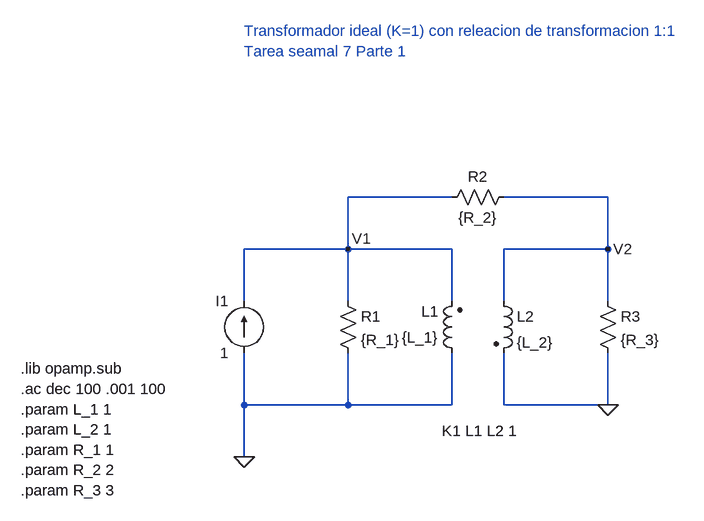
[diagram p0: schematic trafo.asc]
trafo.asc, the LTspice schematic file:
Version 4
SHEET 1 1780 1008
WIRE 720 240 560 240
WIRE 960 240 800 240
WIRE 560 320 560 240
WIRE 560 320 400 320
WIRE 720 320 560 320
WIRE 960 320 960 240
WIRE 960 320 800 320
WIRE 400 400 400 320
WIRE 560 400 560 320
WIRE 720 400 720 320
WIRE 800 400 800 320
WIRE 960 400 960 320
WIRE 400 560 400 480
WIRE 560 560 560 480
WIRE 560 560 400 560
WIRE 720 560 720 480
WIRE 720 560 560 560
WIRE 800 560 800 480
WIRE 960 560 960 480
WIRE 960 560 800 560
WIRE 400 640 400 560
FLAG 400 640 0
FLAG 960 560 0
FLAG 560 320 V1
FLAG 960 320 V2
SYMBOL res 944 384 R0
SYMATTR InstName R3
SYMATTR Value {R_3}
SYMBOL ind2 736 496 R180
WINDOW 0 36 80 Left 2
WINDOW 3 36 40 Left 2
SYMATTR InstName L1
SYMATTR Value {L_1}
SYMATTR Type ind
SYMBOL ind2 784 384 R0
SYMATTR InstName L2
SYMATTR Value {L_2}
SYMATTR Type ind
SYMBOL res 544 384 R0
SYMATTR InstName R1
SYMATTR Value {R_1}
SYMBOL res 816 224 R90
WINDOW 0 0 56 VBottom 2
WINDOW 3 32 56 VTop 2
SYMATTR InstName R2
SYMATTR Value {R_2}
SYMBOL current 400 480 R180
WINDOW 0 24 80 Left 2
WINDOW 3 24 0 Left 2
SYMATTR InstName I1
SYMATTR Value 1
SYMATTR Value2 AC 1
TEXT 56 504 Left 2 !.lib opamp.sub\n.ac dec 100 .001 100\n.param L_1 1\n.param L_2 1\n.param R_1 1\n.param R_2 2\n.param R_3 3
TEXT 400 -16 Left 2 ;Transformador ideal (K=1) con releacion de transformacion 1:1\nTarea seamal 7 Parte 1
TEXT 704 600 Left 2 !K1 L1 L2 1

The netlist it stands for:
* trafo.asc
R3 V2 0 {R_3}
L1 0 V1 {L_1}
L2 V2 0 {L_2}
R1 V1 0 {R_1}
R2 V2 V1 {R_2}
I1 0 V1 1 AC 1
.lib opamp.sub
.ac dec 100 .001 100
.param L_1 1
.param L_2 1
.param R_1 1
.param R_2 2
.param R_3 3
* Transformador ideal (K=1) con releacion de transformacion 1:1
* Tarea seamal 7 Parte 1
K1 L1 L2 1
.backanno
.end